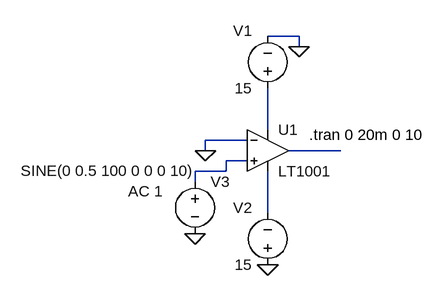
[diagram p0: schematic LT1001_lab2_q3e.asc]
LT1001_lab2_q3e.asc, the LTspice schematic file:
Version 4
SHEET 1 880 680
WIRE 160 80 112 80
WIRE 160 96 160 80
WIRE 112 224 112 160
WIRE 80 240 16 240
WIRE 16 256 16 240
WIRE 224 256 144 256
WIRE 80 272 48 272
WIRE 48 288 48 272
WIRE 48 288 0 288
WIRE 0 304 0 288
WIRE 112 352 112 288
FLAG 160 96 0
FLAG 112 432 0
FLAG 0 384 0
FLAG 16 256 0
SYMBOL Opamps\\LT1001 112 192 R0
SYMATTR InstName U1
SYMBOL voltage 112 176 R180
WINDOW 0 24 104 Left 0
WINDOW 3 24 16 Left 0
WINDOW 123 0 0 Left 0
WINDOW 39 0 0 Left 0
SYMATTR InstName V1
SYMATTR Value 15
SYMBOL voltage 112 448 R180
WINDOW 0 24 104 Left 0
WINDOW 3 24 16 Left 0
WINDOW 123 0 0 Left 0
WINDOW 39 0 0 Left 0
SYMATTR InstName V2
SYMATTR Value 15
SYMBOL voltage 0 288 R0
WINDOW 3 -268 -1 Left 0
WINDOW 123 -103 31 Left 0
WINDOW 39 0 0 Left 0
SYMATTR Value SINE(0 0.5 100 0 0 0 10)
SYMATTR Value2 AC 1
SYMATTR InstName V3
TEXT 176 232 Left 0 !.tran 0 20m 0 10

The netlist it stands for:
* LT1001_lab2_q3e.asc
XU1 N003 0 N001 N004 N002 LT1001  ; pins In+ In- V+ V- OUT
V1 N001 0 15
V2 0 N004 15
V3 N003 0 SINE(0 0.5 100 0 0 0 10) AC 1
.tran 0 20m 0 10
.lib LTC.lib
.backanno
.end